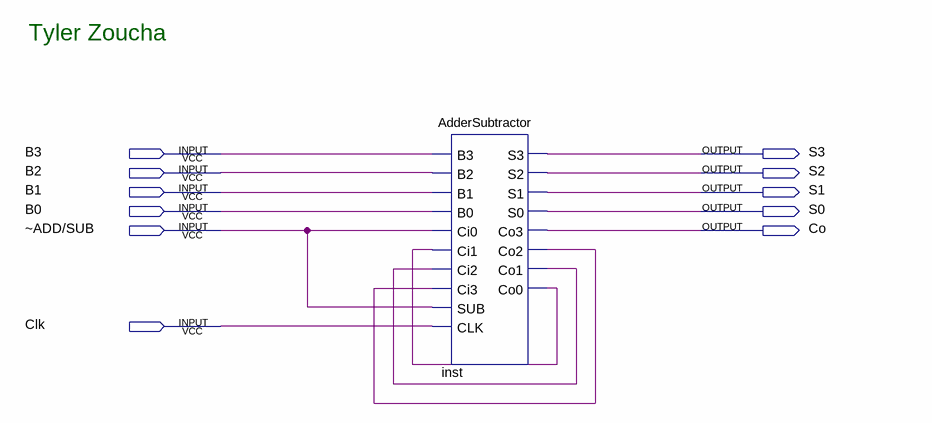
[diagram p0: schematic sheet]
// Quartus schematic Schematic.bdf as structural Verilog: 1 symbols, 11 pins
module Schematic (
  input  B3,
  input  B2,
  input  B1,
  input  B0,
  input  \~ADD/SUB ,
  input  Clk,
  output S3,
  output S2,
  output S1,
  output S0,
  output Co
);

  wire inst_co0, inst_co1, inst_co2;

  AdderSubtractor inst (
    .B3(B3), .B2(B2), .B1(B1), .B0(B0), .Ci0(\~ADD/SUB ), .Ci1(inst_co0), .Ci2(inst_co1), .Ci3(inst_co2),
    .SUB(\~ADD/SUB ), .CLK(Clk), .S3(S3), .S2(S2), .S1(S1), .S0(S0), .Co3(Co), .Co2(inst_co2),
    .Co1(inst_co1), .Co0(inst_co0));

  // Notes on the sheet:
  //   Tyler Zoucha
endmodule
